# EasyEDA Pro project ProPrj_STM32H723.epro, board PCB1
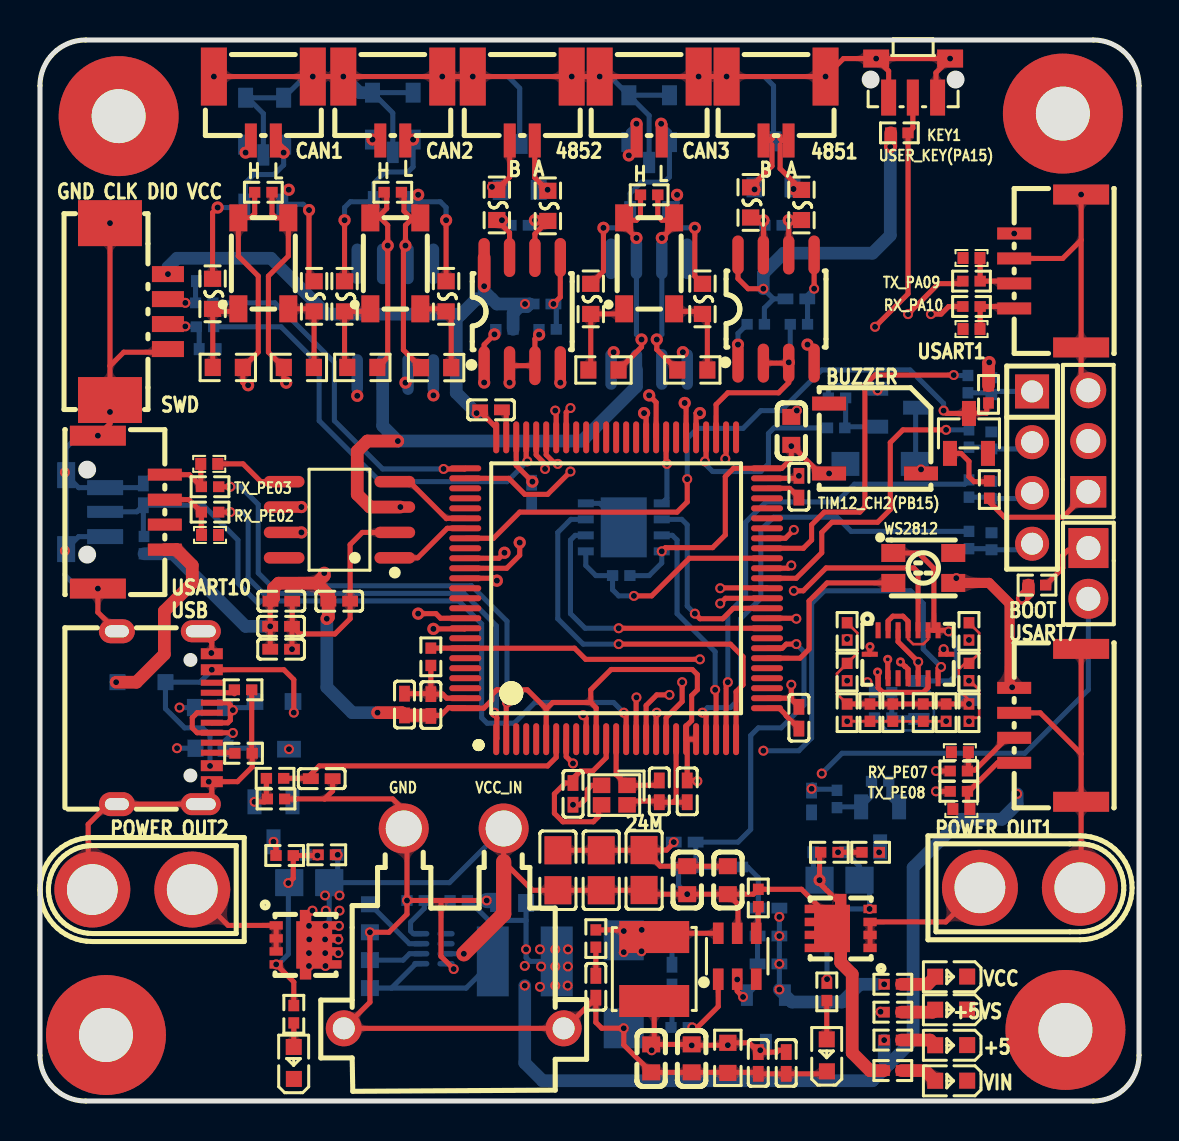
[diagram p5: board, top side]
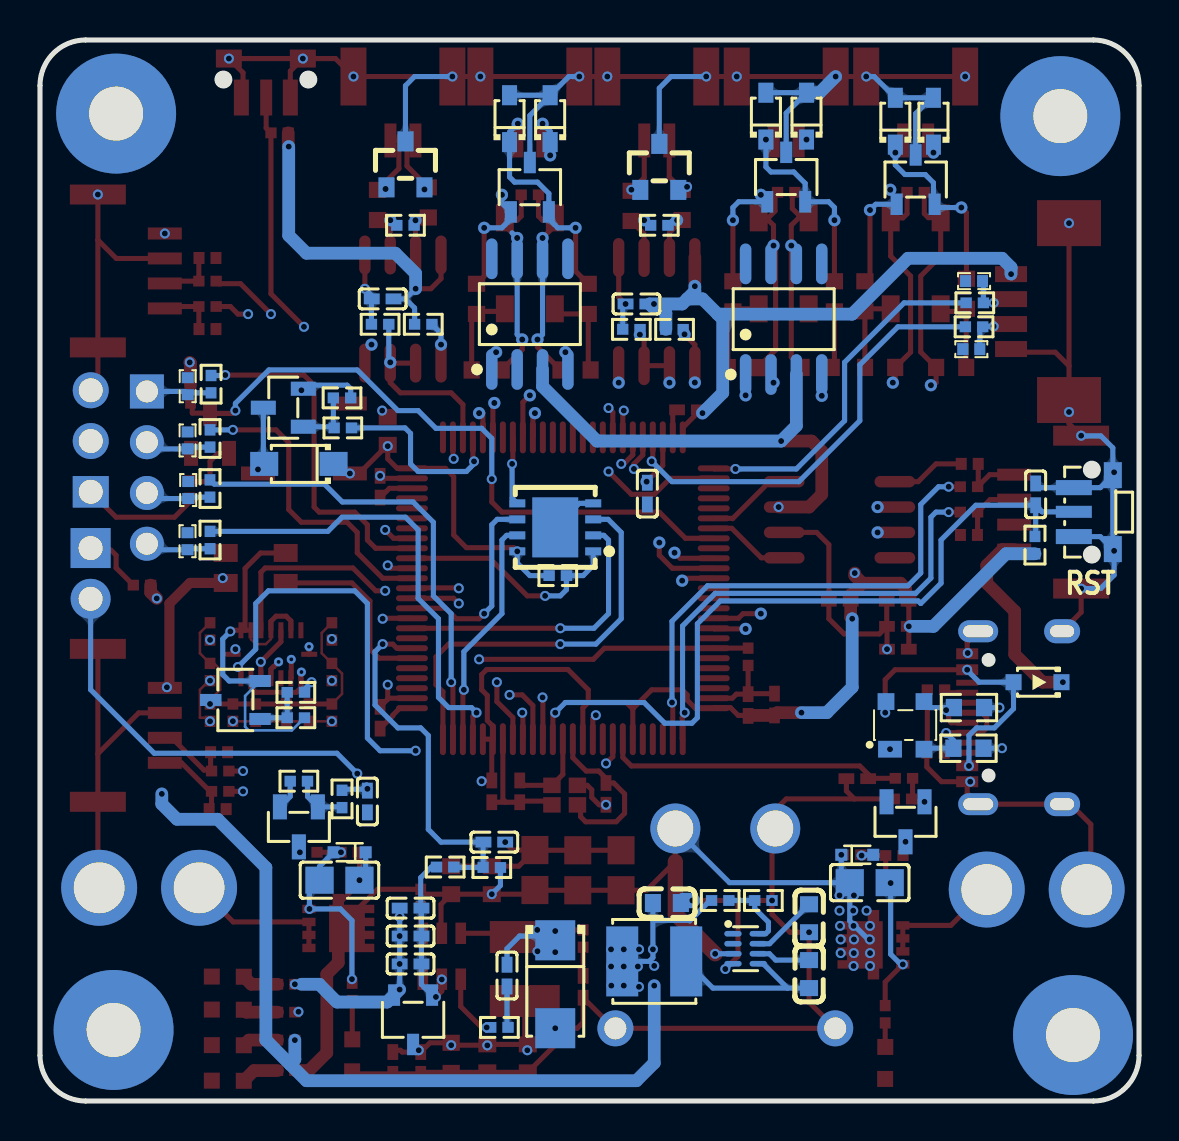
[diagram p6: board, bottom side, seen from below]

Outline 54.99 x 53.09 mm; copper layers: Top Layer, Inner1, Inner2, Bottom Layer. Coordinates in mm from the lower left corner of the outline.
Outline path: 0,50.8 0,2.29 arc(0.67,0.67) 2.29,0 52.71,0 arc(54.32,0.67) 54.99,2.29 54.99,50.8 arc(54.32,52.42) 52.71,53.09 2.29,53.09 arc(0.67,52.42) 0,50.8
Stack: Top Layer 0.035mm 外层铜厚1oz / Dielectric1 0.2104mm 7628 RC49% 8.6mil / Inner1 0.0152mm 内层铜厚 / Dielectric2 1.065mm 1.1mm H/HOZ 含铜 / Inner2 0.0152mm 内层铜厚 / Dielectric3 0.2104mm 7628 RC49% 8.6mil / Bottom Layer 0.035mm 外层铜厚1oz

## Design rules (mm)
template: 自定义配置
spacing copperThickness1oz (default): track to track 0.102, other pairs 0.076 to 0.3
spacing copperThickness2oz: track to track 0.203, other pairs 0.152 to 0.3
track width copperThickness1oz (default): min 0.127, default 0.254, max 2.54
track width copperThickness2oz: min 0.203, default 0.254, max 2.54
differential pair differentialPair (default): width min 0.127, default 0.254, max 2.54; gap min 0.152, default 0.152
via viaSize (default): diameter min 0.45, default 0.61, max 10; hole min 0.201, default 0.305, max 6.299

## Placement (name value [footprint] x y rotation side)
BUZZER1  4kHz  [BUZ-SMD_L5.0-W5.5-P4.60]  41.78 33.15 0 top
C1  2.2uF  [C0402]  37.97 30.73 270 top
C2  2.2uF  [C0402]  24.6 30.39 270 bottom
C3  10pF  [C0402]  30.99 15.49 270 top
C4  10pF  [C0402]  26.67 15.37 90 top
C5  100nF  [C0402]  5.17 30.35 270 bottom
C6  100nF  [C0402]  12.08 25.01 180 top
C7  100nF  [C0402]  12.06 22.61 180 top
C8  100nF  [C0402]  12.06 23.75 180 top
C9  100nF  [C0402]  22.57 34.58 180 top
C10  100nF  [C0402]  37.97 19.18 90 top
C11  100nF  [C0402]  19.56 19.81 270 top
C12  100nF  [C0402]  14.97 25.01 180 top
C13  100nF  [C0402]  32.38 15.49 90 top
C14  100nF  [C0402]  18.24 19.84 90 top
C15  100nF  [C0402]  32.26 12.95 0 bottom
C16  22uF  [C0603]  37.59 33.53 270 top
C17  10uF  [C0805]  30.23 11.56 270 top
C18  100nF  [C0603]  32.38 11.05 270 top
C19  100nF  [C0603]  16.51 6.35 270 bottom
C20  4.7uF  [C0603]  23.62 9.91 0 bottom
C21  33nF  [C0603]  16.51 9.14 270 bottom
C22  10uF  [C0805]  25.92 11.55 270 top
C23  10uF  [C0805]  28.08 11.55 270 top
C24  100nF  [C0603]  34.42 11.05 270 top
C25  100nF  [C0402]  31.62 6.28 90 bottom
C26  100nF  [C0402]  27.81 5.71 90 top
C27  33pF  [C0402]  35.94 1.9 90 top
C28  22uF  [C0603]  30.58 2.13 90 top
C29  22uF  [C0603]  32.61 2.13 90 top
C30  100nF  [C0402]  37.34 1.9 90 top
C31  100nF  [C0402]  36.45 9.65 0 bottom
C32  100nF  [C0402]  36.45 8.25 0 bottom
C33  100nF  [C0402]  36.45 6.86 0 bottom
C34  220nF  [C0805]  40 11.05 180 bottom
C35  100nF  [C0402]  38.61 14.99 90 bottom
C36  220nF  [C0805]  13.47 10.93 0 bottom
C37  100nF  [C0402]  14.1 16.13 180 top
C38  100nF  [C0402]  37.85 40.13 0 bottom
C39  100nF  [C0402]  25.15 39.88 0 bottom
CN1  532610471  [CONN-SMD_4P-P1.25_53261-0471]  4.95 39.5 270 top
CN2  A1257WV-S-4P-LCP  [CONN-SMD_A1257WV-S-4P]  50.42 18.8 90 top
CN3  A1257WV-S-4P-LCP  [CONN-SMD_A1257WV-S-4P]  4.57 29.46 270 top
CN4  A1257WV-S-4P-LCP  [CONN-SMD_A1257WV-S-4P]  50.42 41.53 90 top
CN5  XT30PW-M  [CONN-TH_XT30PW-M]  20.7 8.64 0 top
CN7  XT30U-M  [CONN-TH_XT30U-M]  49.53 10.67 0 top
CN8  XT30U-M  [CONN-TH_XT30U-M]  5.12 10.58 180 top
D2  PRTR5V0U2X  [SOT-143-4_L2.9-W1.3-P1.92-LS2.4-BL]  11.71 18.79 180 bottom
D3  SD103AWS  [SOD-323_L1.7-W1.3-LS2.5-RD]  5.08 20.95 0 bottom
D4  ESD9B5VL  [DFN1006-2L-BI]  8.39 37.62 180 bottom
D5  ESD9B5VL  [DFN1006-2L-BI]  8.25 41.02 180 bottom
D6  ESD9B5VL  [DFN1006-2L-BI]  46.03 17.45 0 top
D7  ESD9B5VL  [DFN1006-2L-BI]  46.1 14.6 0 top
D8  ESD9B5VL  [DFN1006-2L-BI]  8.51 28.32 180 top
D9  ESD9B5VL  [DFN1006-2L-BI]  8.47 31.88 180 top
D10  ESD9B5VL  [DFN1006-2L-BI]  46.61 42.18 0 top
D11  ESD9B5VL  [DFN1006-2L-BI]  46.61 38.62 0 top
D12  DSK36  [SOD-123FL_L2.7-W1.8-LS3.8-RD]  42.04 31.88 0 bottom
D13  ESD9B5VL  [DFN1006-2L-BI]  47.6 35.76 270 bottom
D14  ESD9B5VL  [DFN1006-2L-BI]  47.6 33.05 270 bottom
D15  ESD9B5VL  [DFN1006-2L-BI]  47.58 30.57 270 bottom
D16  ESD9B5VL  [DFN1006-2L-BI]  47.61 28.01 270 bottom
D17  SS34  [SMA_L4.3-W2.6-LS5.2-RD]  29.21 5.84 270 bottom
D18  BZX584C9V1  [SOD-523_L1.2-W0.8-LS1.6-FD]  39.5 12.45 180 bottom
D19  BZX584C9V1  [SOD-523_L1.2-W0.8-LS1.6-FD]  14.1 12.32 0 bottom
D20  PESD1CAN  [SOT-23-3_L2.9-W1.6-P1.90-LS2.8-BR]  11.18 46.1 270 bottom
D21  PESD1CAN  [SOT-23-3_L2.9-W1.6-P1.90-LS2.8-BR]  17.65 46.23 270 bottom
D22  PESD1CAN  [SOT-23-3_L2.9-W1.6-P1.90-LS2.8-BR]  30.48 45.72 270 bottom
D23  1N5819WS  [SOD-323_L1.8-W1.3-LS2.5-RD]  10.29 49.02 90 bottom
D24  1N5819WS  [SOD-323_L1.8-W1.3-LS2.5-RD]  12.19 49.02 90 bottom
D25  1N5819WS  [SOD-323_L1.8-W1.3-LS2.5-RD]  16.64 49.28 90 bottom
D26  1N5819WS  [SOD-323_L1.8-W1.3-LS2.5-RD]  18.67 49.28 90 bottom
D27  1N5819WS  [SOD-323_L1.8-W1.3-LS2.5-RD]  29.46 49.15 90 bottom
D28  1N5819WS  [SOD-323_L1.8-W1.3-LS2.5-RD]  31.5 49.15 90 bottom
D29  PSM712  [SOT-23_L2.9-W1.3-P1.90-LS2.4-BR]  36.7 46.86 270 bottom
D30  PSM712  [SOT-23_L2.9-W1.3-P1.90-LS2.4-BR]  24 46.74 270 bottom
F1  JK-SMD0603-005  [F0603]  13.72 40.26 90 top
F2  JK-SMD0603-005  [F0603]  8.64 40.39 90 top
F3  JK-SMD0603-005  [F0603]  20.32 40.26 90 top
F4  JK-SMD0603-005  [F0603]  15.24 40.26 90 top
F5  JK-SMD0603-005  [F0603]  33.15 40.13 90 top
F6  JK-SMD0603-005  [F0603]  27.56 40.13 90 top
F7  JK-SMD0603-005  [F0603]  35.56 44.96 90 top
F8  JK-SMD0603-005  [F0603]  38.1 44.83 90 top
F9  JK-SMD0603-005  [F0603]  22.86 44.83 90 top
F10  JK-SMD0603-005  [F0603]  25.41 44.79 90 top
H1  PZ254V-11-02P  [HDR-TH_2P-P2.54-V-M]  52.46 26.4 270 top
H2  PZ254V-11-04P  [HDR-TH_4P-P2.54-V-M]  49.64 31.69 270 top
H3  2.54-1*3P针  [HDR-TH_3P-P2.54-V-M-1]  52.45 33.02 90 top
L1  10uH  [IND-SMD_L4.0-W4.0]  24.26 6.98 0 bottom
L2  10uH  [IND-SMD_L4.0-W4.0]  30.73 6.6 270 top
L7  ACT45B-101-2P-TL003  [FILTER-SMD_4P-L4.5-W3.2-TL_ACT45B]  11.18 41.91 90 top
L8  ACT45B-101-2P-TL003  [FILTER-SMD_4P-L4.5-W3.2-TL_ACT45B]  17.78 41.91 90 top
L9  ACT45B-101-2P-TL003  [FILTER-SMD_4P-L4.5-W3.2-TL_ACT45B]  30.48 41.91 90 top
LED1  XL-3528RGBW-WS2812B  [LED-SMD_4P-L3.5-W2.8-BR-1]  44.2 26.67 180 top
LED2  KT-0603R  [LED0603-RD]  39.37 2.29 90 top
LED3  KT-0603R  [LED0603-RD]  12.7 1.9 90 top
LED4  KT-0603R  [LED0603-RD]  45.59 6.22 180 top
LED5  KT-0603R  [LED0603-RD]  45.59 1.02 180 top
LED6  KT-0603R  [LED0603-RD]  45.59 2.79 180 top
LED7  KT-0603R  [LED0603-RD]  45.59 4.57 180 top
NOREF  -  [Pad_e340]  51.18 49.4 0 top
NOREF#2  -  [Pad_e373]  3.3 3.3 0 top
NOREF#3  -  [Pad_e336]  3.94 49.28 0 top
NOREF#4  -  [Pad_e374]  51.31 3.56 0 top
Q1  CJ2310  [SOT-23-3_L2.9-W1.6-P1.90-LS2.8-BR]  45.21 20.07 180 bottom
Q2  SS8050  [SOT-23-3_L2.9-W1.3-P1.90-LS2.4-BR]  42.81 34.69 180 bottom
Q3  SS8050  [SOT-23-3_L2.9-W1.3-P1.90-LS2.4-BR]  42.04 13.72 90 bottom
Q4  SS8050  [SOT-23-3_L2.9-W1.3-P1.90-LS2.4-BR]  11.68 13.97 90 bottom
Q5  SS8050  [SOT-23-3_L2.9-W1.3-P1.90-LS2.4-BR]  46.48 33.4 270 top
R1  22Ω  [R0603]  8.51 19.68 0 bottom
R2  22Ω  [R0603]  8.53 17.65 0 bottom
R8  22Ω  [R0402]  49.89 25.81 180 top
R9  10kΩ  [R0402]  19.56 22.22 270 top
R10  10kΩ  [R0402]  5.21 27.81 270 bottom
R11  4.7kΩ  [R0402]  10.16 20.57 180 top
R12  4.7kΩ  [R0402]  10.19 17.4 180 top
R13  10kΩ  [R0402]  29.08 26.29 180 bottom
R14  22Ω  [R0402]  8.22 39.93 180 bottom
R15  22Ω  [R0402]  8.25 38.73 180 bottom
R16  22Ω  [R0402]  45.97 16.51 0 top
R17  22Ω  [R0402]  45.97 15.49 0 top
R18  22Ω  [R0402]  8.51 29.46 180 top
R19  22Ω  [R0402]  8.51 30.73 180 top
R20  22Ω  [R0402]  46.61 41.02 0 top
R21  22Ω  [R0402]  46.61 39.75 0 top
R22  470Ω  [R0402]  45.34 19.43 270 top
R23  470Ω  [R0402]  44.2 19.43 270 top
R24  470Ω  [R0402]  41.53 19.43 270 top
R25  470Ω  [R0402]  42.67 19.43 270 top
R26  470Ω  [R0402]  40.39 19.43 270 top
R27  470Ω  [R0402]  46.48 19.43 270 top
R28  470Ω  [R0402]  40.39 21.46 270 top
R29  470Ω  [R0402]  46.48 21.46 270 top
R30  470Ω  [R0402]  40.39 23.49 270 top
R31  470Ω  [R0402]  46.48 23.49 270 top
R32  10kΩ  [R0402]  42.19 19.18 0 bottom
R33  100Ω  [R0402]  42.19 20.45 0 bottom
R34  100kΩ  [R0402]  32.38 11.68 180 bottom
R35  10kΩ  [R0402]  34.72 11.71 180 bottom
R36  10kΩ  [R0402]  39.88 35.18 0 bottom
R37  22Ω  [R0402]  39.84 33.68 0 bottom
R38  22Ω  [R0402]  46.48 28.07 90 bottom
R39  22Ω  [R0402]  46.48 30.64 90 bottom
R40  22Ω  [R0402]  46.48 33.15 90 bottom
R41  22Ω  [R0402]  46.43 35.87 90 bottom
R42  51kΩ  [R0402]  20.96 10.03 0 bottom
R43  10kΩ  [R0402]  18.8 10.03 0 bottom
R44  100kΩ  [R0402]  35.94 10.16 270 top
R45  10Ω  [R0402]  32 3.68 180 bottom
R46  10Ω  [R0402]  27.81 8.13 90 top
R47  39kΩ  [R0603]  34.42 2.16 90 top
R48  10kΩ  [R0402]  39.5 12.45 180 top
R49  10kΩ  [R0402]  41.56 12.44 180 top
R50  1kΩ  [R0402]  39.88 15.11 90 bottom
R51  10kΩ  [R0402]  42.04 16 180 bottom
R52  100kΩ  [R0402]  39.37 5.46 90 top
R53  10kΩ  [R0402]  14.35 12.32 0 top
R54  10kΩ  [R0402]  12.24 12.28 0 top
R55  1kΩ  [R0402]  11.76 16.14 0 top
R56  10kΩ  [R0402]  11.81 15.11 180 top
R57  100kΩ  [R0402]  12.7 4.34 90 top
R58  120Ω  [R0402]  11.18 45.47 0 top
R59  120Ω  [R0402]  17.65 45.47 0 top
R60  120Ω  [R0402]  30.48 45.34 0 top
R61  2.2Ω  [R0603]  12.95 36.7 0 top
R62  2.2Ω  [R0603]  9.4 36.7 180 top
R63  2.2Ω  [R0603]  19.82 36.69 0 top
R64  2.2Ω  [R0603]  16.13 36.7 180 top
R65  2.2Ω  [R0603]  32.64 36.58 0 top
R66  2.2Ω  [R0603]  28.19 36.58 180 top
R68  120Ω  [R0402]  36.7 43.81 180 bottom
R69  10kΩ  [R0402]  23.24 38.61 0 bottom
R70  10kΩ  [R0402]  35.81 38.86 0 bottom
R71  10kΩ  [R0402]  37.97 38.86 180 bottom
R72  10kΩ  [R0402]  25.4 38.61 180 bottom
R73  120Ω  [R0402]  24 43.81 180 bottom
R74  4.7kΩ  [R0402]  47.5 30.59 90 top
R75  4.7kΩ  [R0402]  47.46 35.35 90 top
R76  10kΩ  [R0402]  43 48.44 180 top
R96  10kΩ  [R0402]  42.67 4.44 0 top
R97  10kΩ  [R0402]  42.67 3.05 0 top
R98  10kΩ  [R0402]  42.67 1.52 0 top
R99  10kΩ  [R0402]  42.67 5.84 0 top
SW1  SKRTLAE010  [KEY-SMD_SKRTLAE010]  43.69 51.18 180 top
SW2  SKRTLAE010  [KEY-SMD_SKRTLAE010]  2.29 29.46 90 bottom
U1  STM32H723VGT6  [LQFP-100_L14.0-W14.0-P0.50-LS16.0-BL]  28.83 25.65 0 top
U2  W25Q64JVXGIQ  [XSON-8_L4.0-W4.0-P0.80-TL-EP]  29.21 28.7 0 bottom
U3  BMI088  [LGA-16_L4.5-W3.0-P0.50-BL]  43.43 22.35 270 top
U4  TPS62932DRLR  [SMD-8_L2.1-W1.2-P0.50-LS1.6-BL]  19.69 7.62 270 bottom
U5  BL9342  [SOT-23-6_L2.9-W1.6-P0.95-LS2.8-BL]  34.89 7.24 0 top
U6  XC6206P332MR-G  [SOT-23-3_L2.9-W1.6-P1.90-LS2.8-BR]  36.32 4.06 90 bottom
U9  S40N06D  [WDFN-5_L3.3-W3.3-P0.65-BL]  40.8 8.63 90 top
U11  S40N06D  [WDFN-5_L3.3-W3.3-P0.65-BL]  12.55 7.81 270 top
U13  TJA1057T/1Z  [SOP-8_L5.0-W4.0-P1.27-LS6.0-BL]  17.78 39.12 180 bottom
U14  TJA1057T/1Z  [SOP-8_L5.0-W4.0-P1.27-LS6.0-BL]  14.99 29.08 90 top
U15  TJA1057T/1Z  [SOP-8_L5.0-W4.0-P1.27-LS6.0-BL]  30.48 39.37 180 bottom
U16  SM02B-GHS-TB(LF)(SN)  [CONN-SMD_SM02B-GHS-TB-LF-SN]  11.18 49.66 180 top
U17  SM02B-GHS-TB(LF)(SN)  [CONN-SMD_SM02B-GHS-TB-LF-SN]  17.65 49.66 180 top
U18  SM02B-GHS-TB(LF)(SN)  [CONN-SMD_SM02B-GHS-TB-LF-SN]  30.48 49.66 180 top
U19  SP3485EN-L/TR  [SOIC-8_L5.0-W4.0-P1.27-LS6.0-BL]  36.83 39.62 0 top
U20  SP3485EN-L/TR  [SOIC-8_L5.0-W4.0-P1.27-LS6.0-BL]  24.13 39.5 0 top
U21  SM02B-GHS-TB(LF)(SN)  [CONN-SMD_SM02B-GHS-TB-LF-SN]  36.83 49.66 180 top
U22  SM02B-GHS-TB(LF)(SN)  [CONN-SMD_SM02B-GHS-TB-LF-SN]  24.13 49.66 180 top
USB1  TYPE-C 16PIN 2MD(073)  [USB-C-SMD_TYPE-C-6PIN-2MD-073]  6.22 19.18 270 top
X1  24MHz  [CRYSTAL-SMD_4P-L2.0-W1.6-BL-A]  28.74 15.31 180 top

## Footprints (pads in the part's own frame, mm; a bottom-side part is the same pattern mirrored in y, then rotated)
BUZ-SMD_L5.0-W5.5-P4.60
  rect 1.7x0.7 smd: 1(-2.3,-1.75) 2(2.3,-1.75) 3(-2.3,1.75)
C0402
  rect 0.79x0.54 smd: 1(-0.545,0) 2(0.545,0)
C0603
  rect 0.8x0.9 smd: 1(-0.7,0) 2(0.7,0)
C0805
  rect 1.41x1.35 smd: 1(-1,0) 2(1,0)
CONN-SMD_4P-P1.25_53261-0471
  rect 0.8x1.6 smd: 1(-1.875,1.45) 2(-0.625,1.45) 3(0.625,1.45) 4(1.875,1.45)
  rect 2.3x3.2 smd: 5(4.425,-1.45) 6(-4.425,-1.45)
CONN-SMD_A1257WV-S-4P
  rect 0.6x1.7 smd: 1(1.875,1.675) 2(0.625,1.675) 3(-0.625,1.675) 4(-1.875,1.675)
  rect 1x2.8 smd: 5(3.825,-1.675) 6(-3.825,-1.675)
CONN-SMD_SM02B-GHS-TB-LF-SN
  rect 0.6x1.7 smd: 1(-0.625,1.6) 2(0.625,1.6)
  rect 1.3x2.9 smd: 3(2.475,-1.6) 4(-2.475,-1.6)
CONN-TH_XT30PW-M
  round 2.5 hole 1.8: 1(-2.5,5) 2(2.5,5)
  round 1.8 hole 1.1: 3(5.5,-5) 4(-5.5,-5)
CONN-TH_XT30U-M
  round 3.8 hole 2.54: 1(-2.5,0) 2(2.5,0)
CRYSTAL-SMD_4P-L2.0-W1.6-BL-A
  rect 0.875x0.775 smd: 1(-0.638,-0.488) 2(0.638,-0.488) 3(0.638,0.488) 4(-0.638,0.488)
DFN1006-2L-BI
  rect 0.55x0.6 smd: 1(-0.425,0) 2(0.425,0)
F0603
  rect 0.806x0.864 smd: 1(-0.753,0) 2(0.753,0)
FILTER-SMD_4P-L4.5-W3.2-TL_ACT45B
  rect 1.35x0.9 smd: 1(-2.275,1.25) 2(-2.275,-1.25) 3(2.275,-1.25) 4(2.275,1.25)
HDR-TH_2P-P2.54-V-M
  rect 2x2 hole 1.2: 1(-1.27,0)
  round 2 hole 1.2: 2(1.27,0)
HDR-TH_3P-P2.54-V-M-1
  rect 1.575x1.8 hole 1.2: 1(-2.54,0)
  round 1.8 hole 1.2: 2(0,0) 3(2.54,0)
HDR-TH_4P-P2.54-V-M
  rect 1.7x1.7 hole 1.1: 1(-3.81,0)
  round 1.7 hole 1.1: 2(-1.27,0) 3(1.27,0) 4(3.81,0)
IND-SMD_L4.0-W4.0
  rect 1.6x3.5 smd: 1(-1.6,0) 2(1.6,0)
KEY-SMD_SKRTLAE010
  rect 0.75x1.8 smd: 1(-1.225,0.975) 3(1.225,0.975)
  rect 0.6x1.8 smd: 2(0.015,0.975)
  rect 1.3x0.9 smd: 4(-1.85,-0.975) 5(1.85,-0.975)
LED0603-RD
  rect 0.8x0.8 smd: 1(-0.799,-0.004) 2(0.799,0.004)
LED-SMD_4P-L3.5-W2.8-BR-1
  rect 1.2x0.9 smd: 1(1.5,-0.75) 2(1.5,0.75) 3(-1.5,0.75) 4(-1.5,-0.75)
LGA-16_L4.5-W3.0-P0.50-BL
  rect 0.8x0.25 smd: 1(-1.2,-1.498) 2(-1.2,-0.998) 3(-1.2,-0.498) 4(-1.2,0.002) 5(-1.2,0.502) 6(-1.2,1.002) 7(-1.2,1.502) 9(1.2,1.502) 10(1.2,1.002) 11(1.2,0.502) 12(1.2,0.002) 13(1.2,-0.498) 14(1.2,-0.998) 15(1.2,-1.498)
  rect 0.25x0.8 smd: 8(0,1.915) 16(0,-1.915)
LQFP-100_L14.0-W14.0-P0.50-LS16.0-BL
  oval 0.3x1.6 smd: 1(-6,-7.55) 2(-5.5,-7.55) 3(-5,-7.55) 4(-4.5,-7.55) 5(-4,-7.55) 6(-3.5,-7.55) 7(-3,-7.55) 8(-2.5,-7.55) 9(-2,-7.55) 10(-1.5,-7.55) 11(-1,-7.55) 12(-0.5,-7.55) 13(0,-7.55) 14(0.5,-7.55) 15(1,-7.55) 16(1.5,-7.55) 17(2,-7.55) 18(2.5,-7.55) 19(3,-7.55) 20(3.5,-7.55) 21(4,-7.55) 22(4.5,-7.55) 23(5,-7.55) 24(5.5,-7.55) 25(6,-7.55) 51(6,7.55) 52(5.5,7.55) 53(5,7.55) 54(4.5,7.55) 55(4,7.55) 56(3.5,7.55) 57(3,7.55) 58(2.5,7.55) 59(2,7.55) 60(1.5,7.55) 61(1,7.55) 62(0.5,7.55) 63(0,7.55) 64(-0.5,7.55) 65(-1,7.55) 66(-1.5,7.55) 67(-2,7.55) 68(-2.5,7.55) 69(-3,7.55) 70(-3.5,7.55) 71(-4,7.55) 72(-4.5,7.55) 73(-5,7.55) 74(-5.5,7.55) 75(-6,7.55)
  oval 1.6x0.3 smd: 26(7.55,-6) 27(7.55,-5.5) 28(7.55,-5) 29(7.55,-4.5) 30(7.55,-4) 31(7.55,-3.5) 32(7.55,-3) 33(7.55,-2.5) 34(7.55,-2) 35(7.55,-1.5) 36(7.55,-1) 37(7.55,-0.5) 38(7.55,0) 39(7.55,0.5) 40(7.55,1) 41(7.55,1.5) 42(7.55,2) 43(7.55,2.5) 44(7.55,3) 45(7.55,3.5) 46(7.55,4) 47(7.55,4.5) 48(7.55,5) 49(7.55,5.5) 50(7.55,6) 76(-7.55,6) 77(-7.55,5.5) 78(-7.55,5) 79(-7.55,4.5) 80(-7.55,4) 81(-7.55,3.5) 82(-7.55,3) 83(-7.55,2.5) 84(-7.55,2) 85(-7.55,1.5) 86(-7.55,1) 87(-7.55,0.5) 88(-7.55,0) 89(-7.55,-0.5) 90(-7.55,-1) 91(-7.55,-1.5) 92(-7.55,-2) 93(-7.55,-2.5) 94(-7.55,-3) 95(-7.55,-3.5) 96(-7.55,-4) 97(-7.55,-4.5) 98(-7.55,-5) 99(-7.55,-5.5) 100(-7.55,-6)
Pad_e336
  round 6 hole 2.7: 101(0,0)
Pad_e340
  round 6 hole 2.7: 101(0,0)
Pad_e373
  round 6 hole 2.7: 101(0,0)
Pad_e374
  round 6 hole 2.7: 101(0,0)
R0402
  rect 0.566x0.54 smd: 1(-0.433,0) 2(0.433,0)
R0603
  rect 0.806x0.864 smd: 1(-0.753,0) 2(0.753,0)
SMA_L4.3-W2.6-LS5.2-RD
  rect 2x2 smd: 1(-2.2,0) 2(2.2,0)
SMD-8_L2.1-W1.2-P0.50-LS1.6-BL
  oval 0.28x0.864 smd: 1(-0.75,-0.632) 2(-0.25,-0.632) 3(0.25,-0.632) 4(0.75,-0.632) 5(0.75,0.632) 6(0.25,0.632) 7(-0.25,0.632) 8(-0.75,0.632)
SOD-123FL_L2.7-W1.8-LS3.8-RD
  rect 1.4x1.2 smd: 1(-1.735,0) 2(1.735,0)
SOD-323_L1.7-W1.3-LS2.5-RD
  rect 0.8x0.8 smd: 1(-1.2,0) 2(1.2,0)
SOD-323_L1.8-W1.3-LS2.5-RD
  rect 1x0.75 smd: 1(-1.173,0) 2(1.173,0)
SOD-523_L1.2-W0.8-LS1.6-FD
  rect 0.6x0.6 smd: 1(-0.8,0) 2(0.8,0)
SOIC-8_L5.0-W4.0-P1.27-LS6.0-BL
  oval 0.569x1.95 smd: 1(-1.905,-2.705) 2(-0.635,-2.705) 3(0.635,-2.705) 4(1.905,-2.705) 5(1.905,2.705) 6(0.635,2.705) 7(-0.635,2.705) 8(-1.905,2.705)
SOP-8_L5.0-W4.0-P1.27-LS6.0-BL
  oval 0.574x2.035 smd: 1(-1.905,-2.768) 2(-0.635,-2.768) 3(0.635,-2.768) 4(1.905,-2.768) 5(1.905,2.768) 6(0.635,2.768) 7(-0.635,2.768) 8(-1.905,2.768)
SOT-23-3_L2.9-W1.3-P1.90-LS2.4-BR
  rect 1.25x0.7 smd: 1(1,-0.95) 2(1,0.95) 3(-1,0)
SOT-23-3_L2.9-W1.6-P1.90-LS2.8-BR
  rect 1.07x0.6 smd: 1(1.235,-0.95) 2(1.235,0.95) 3(-1.235,0)
SOT-23-6_L2.9-W1.6-P0.95-LS2.8-BL
  rect 0.532x1.072 smd: 1(-0.95,-1.149) 2(0,-1.149) 3(0.95,-1.149) 4(0.95,1.149) 5(0,1.149) 6(-0.95,1.149)
SOT-23_L2.9-W1.3-P1.90-LS2.4-BR
  rect 1x0.8 smd: 1(1.15,-0.95) 2(1.15,0.95) 3(-1.15,0)
SOT-143-4_L2.9-W1.3-P1.92-LS2.4-BL
  rect 1.194x0.838 smd: 1(-0.75,-1.192)
  rect 0.838x0.838 smd: 2(0.95,-1.192) 3(0.95,1.192) 4(-0.95,1.192)
USB-C-SMD_TYPE-C-6PIN-2MD-073
  rect 0.55x1.1 smd: 1(-3.2,2.375) 2(-2.4,2.375) 11(2.4,2.375) 12(3.2,2.375)
  rect 0.3x1.1 smd: 3(-1.75,2.375) 4(-1.25,2.375) 5(-0.75,2.375) 6(-0.25,2.375) 7(0.25,2.375) 8(0.75,2.375) 9(1.25,2.375) 10(1.75,2.375)
  oval 1.1x2 hole 0.6x1.5: 13(-4.325,1.825) 14(4.325,1.825)
  oval 1.2x1.8 hole 0.6x1.2: 13(-4.325,-2.375) 14(4.325,-2.375)
WDFN-5_L3.3-W3.3-P0.65-BL
  rect 0.42x0.66 smd: 1(-0.975,-0.735) 2(-0.325,-0.735) 3(0.325,-0.735) 4(0.975,-0.735)
  custom 3.48x2.265 smd: 5(0,0.735)
XSON-8_L4.0-W4.0-P0.80-TL-EP
  rect 0.8x0.4 smd: 1(-1.9,1.2) 2(-1.9,0.4) 3(-1.9,-0.4) 4(-1.9,-1.2) 5(1.9,-1.2) 6(1.9,-0.4) 7(1.9,0.4) 8(1.9,1.2)
  rect 2.3x3 smd: 9(0,0)

## Nets
As in the schematic.

Pads without a net: BUZZER1 3; LED1 4; NOREF 101; NOREF#2 101; NOREF#3 101; NOREF#4 101; U1 9; U3 1 13; U4 1 2; U5 3; USB1 3 9

## Via types
v1: diameter 0.5, hole 0.3, Top Layer to Bottom Layer, 185 vias
v2: diameter 0.5, hole 0.299, Top Layer to Bottom Layer, 5 vias
v3: diameter 0.61, hole 0.305, Top Layer to Bottom Layer, 56 vias
v4: diameter 0.45, hole 0.2, Top Layer to Bottom Layer, 4 vias

## Routing (per net, layer and track width the routed paths; a pad name or vN(x,y) marks a point on that pad's centre or on a via; arc(x,y) is an arc through that point)
+5V: length 127.5
  Top Layer w0.508: LED1.3 47.49,25.92 48.51,24.89 48.51,20.9 CN2.1
  Top Layer w0.635: CN3.1 6.83,27.59 7.62,26.8 7.62,25.91 6.22,24.51 6.22,22.35 4.83,20.95 v1(3.81,20.95)
  Inner2 w0.635: 12.95,13.97 14.26,13.97 17.06,11.18 22.48,11.18 24.64,9.02 ; v1(48.9,15.37) 48.9,20.45 v1(48.64,20.7) 50.93,22.99 50.93,25.27 50.04,26.16 48.9,26.16 47.75,27.3 47.75,36.07 50.16,38.48 50.16,42.29 49.02,43.43 ; 12.7,13.97 9.53,13.97 9.02,13.46 7.05,13.46 3.81,16.7 v1(3.81,20.95)
  Bottom Layer w0.254: L1.2 24.51,6.98 24.32,7.17 v1(24.32,7.59) 24.32,9.04 ; 24.32,9.04 22.5,9.04 22.48,9.02 21.46,10.03 R42.2 ; 24.32,9.04 C20.2
  Bottom Layer w0.635: 42.48,1.84 41.66,1.02 25.15,1.02 24.26,1.9 v1(24.26,5.77) ; 42.48,1.84 43.69,3.05 43.69,11.68 46.1,14.1 48.13,14.1 48.9,14.86 v1(48.9,15.37) ; 42.48,1.84 42.24,2.08 v2(42.24,3.05)
  vias: v1(24.26,6.76) v1(25.02,7.59) v1(25.02,5.71) v1(25.08,6.73) v1(25.78,7.59) v1(25.78,6.73) v1(25.78,5.77) v1(26.42,7.59) v1(26.42,6.73) v1(26.4,5.77) v1(45.85,26.16) v1(48.74,43.4)
+5VS: length 116.9
  Top Layer w0.254: L2.2 30.73,2.98 C28.2 C29.2 32.65,2.79 v1(34.42,2.79) R47.2 35.48,2.91 35.94,2.45 36.87,2.45 36.96,2.54 37.25,2.54 37.34,2.45
  Top Layer w0.635: v1(17.91,33.02) 16.38,33.02 15.88,32.51 15.88,30.35 16.51,29.72 v1(18.03,29.72)
  Inner2 w0.635: v1(18.03,29.72) 17.65,29.34 17.65,19.3 20.96,16 24.38,16 31.24,9.14 31.24,3.17 v1(30.61,2.54) ; H3.2 54.36,31.11 54.36,15.49 53.09,14.22 44.58,14.22 43.05,12.7 43.05,5.46 v2(42.06,4.46) 40.13,2.54 v1(36.04,2.54) 34.8,2.54
  Bottom Layer w0.254: U6.3 36.32,2.82 v1(36.04,2.54)
  Bottom Layer w0.635: U13.3 17.15,33.78 v1(17.91,33.02) 27.12,33.02 29.84,35.75 U15.3
  vias: v1(32.61,2.78)
GND: length 300.9
  Top Layer w0.127: U3.6 44.44,23.1 44.2,22.86 43.69,22.86 43.44,23.11 U3.4
  Top Layer w0.254: CN7.2 52.09,10.73 CN2.6 52.09,17.37 ; v1(25.69,39.88) 26.03,40.22 U20.5 ; C11.1 19.53,20.38 C14.2 ; C11.1 R9.2 ; C11.1 20.15,20.36 20.35,20.15 U1.99 ; C8.1 12.62,23.76 C6.1 ; C8.1 v1(12.61,22.61) ; C8.1 12.99,23.37 14.76,23.37 15.52,24.13 15.52,27.84 16.13,28.45 U14.2 ; v1(20.7,6.6) 20.07,7.24 20.07,10.02 20.08,10.03 ; 52.09,43.08 CN4.6 52.09,35.92 H3.3 ; 52.09,43.08 51.17,42.15 CN4.2 ; 52.09,43.08 v1(52.09,45.35) ; 44.73,23.55 44.73,26.65 43.95,27.42 LED1.1 ; 44.73,23.55 U3.6 ; 44.73,23.55 U3.7 45.41,23.55 v1(45.47,23.49) ; SW1.1 44.83,50.29 44.83,51.45 v1(45.54,52.16) v1(41.84,52.16) ; USB1.13 2.9,24.45 v1(2.9,25.64) ; v1(41.84,52.16) 40.2,52.16 v1(39.31,51.26) v1(34.35,51.26) v1(32.96,51.26) v1(28,51.26) v1(26.6,51.26) v1(21.66,51.26) v1(20.13,51.26) v1(15.18,51.26) v1(13.65,51.26) v1(8.7,51.26) ; v1(41.84,52.16) 42.46,51.53 SW1.3 ; 29.59,15.01 31.06,15.01 31.12,14.95 31.69,14.95 ; 14.24,15.11 R56.1 ; 14.24,15.11 17.65,15.11 18.2,14.56 CN5.1 18.36,13.47 v1(18.36,10.03) ; 14.24,15.11 14.64,15.51 C37.1 ; U1.26 36.99,19.65 37.34,19.3 37.34,19.27 C10.1 ; v1(2.9,33.29) 3.5,33.89 v1(3.5,34.47) CN1.5 3.5,36.78 ; U3.2 42.44,24.02 42.67,24.26 43.18,24.26 43.44,24 U3.4 ; 31.69,14.95 31.83,15.09 U1.19 ; 31.69,14.95 C13.1 ; v1(37.97,31.28) 37.85,31.15 U1.49 ; 3.5,36.78 v1(3.5,43.92) ; 3.5,36.78 4.19,37.46 6.25,37.46 CN1.4 ; v1(22.35,10.03) 20.08,10.03 ; 20.08,10.03 v1(18.36,10.03) ; X1.2 27.6,15.79 27.38,15.57 27.38,15.19 27.01,14.82 v1(26.67,14.82) ; U1.10 27.33,19.15 v1(27.18,19.3) ; CN8.2 2.41,10.79 2.41,13.84 3.42,14.85 USB1.14 USB1.14 8.6,15.4 USB1.12 9.88,15.98 10.62,16.71 R12.1 10.59,17.42 R11.1 ; 52.09,17.37 50.05,19.42 CN2.2 ; 52.09,17.37 CN2.5 ; C17.1 30.21,12.55 C23.1 C22.1 ; C17.1 31.03,11.75 C18.1 C24.1 34.54,11.62 ; C17.1 31.35,12.56 31.62,12.83 ; USB1.1 8.6,22.95 USB1.13 ; LED2.1 39.25,1.36 C30.1 C27.1 35.87,1.43 C29.1 C28.1 29.21,2.81 v1(29.21,3.64) 28.11,3.64 27.81,3.94 C26.1 26.28,3.64 CN5.3 CN5.4 16.51,4.94 v1(16.51,8.44) 17.46,8.44 18.36,9.35 v1(18.36,10.03) ; U19.5 v1(38.74,40.64) ; v1(34.89,6.08) 34.89,5.5 v1(35.18,5.21) ; U14.5 11.05,30.99 10.16,31.88 D9.1 ; C9.1 23.33,34.37 U1.74
  Bottom Layer w0.127: Q1.2 44.73,20.26 44.73,18.73 44.54,18.54 42.39,18.54 R32.1
  Bottom Layer w0.254: v1(20.7,6.6) 20.44,6.87 U4.4 ; C5.1 4.96,30.69 SW2.3 1.94,30.69 1.31,31.31 ; SW2.1 1.94,28.24 SW2.4 1.31,31.31 ; U2.4 28.01,29.9 U2.9 ; D21.3 17.65,49.43 D25.2 D26.2 ; R35.1 35.41,11.71 35.94,11.18 35.94,9.69 C31.1 C32.1 C33.1 35.9,5.83 U6.1 ; v1(45.47,23.49) 45.85,23.11 45.85,21.34 45.53,21.02 Q1.2 ; C38.2 38.39,40.17 38.41,40.18 ; D23.2 10.38,50.19 ; 10.38,50.19 11.18,49.4 D20.3 ; 10.38,50.19 D24.2 13.25,51.26 v1(13.65,51.26) ; v1(21.66,51.26) 23.42,51.26 24,50.67 D30.3 ; D27.2 D28.2 ; D27.2 28.53,51.26 v1(28,51.26) ; D27.2 30.48,49.31 D22.3 ; R72.1 25.83,39.74 v1(25.69,39.88) ; 1.31,31.31 1.31,32.68 1.91,33.27 2.88,33.27 v1(2.9,33.29) ; v1(38.74,40.64) 38.41,40.31 38.41,40.18 ; v1(1.25,27.53) 1.25,26.31 1.92,25.64 v1(2.9,25.64) ; 38.41,40.18 R71.1 ; Q2.2 41.64,35.81 39.62,35.81 39.44,35.63 39.44,35.18 ; v1(34.35,51.26) 36.25,51.26 36.7,50.8 D29.3 ; R51.1 42.47,15.23 Q3.2
  Bottom Layer w0.635: D25.2 15.99,50.45 v1(15.18,51.26)
  Bottom Layer w0.762: v1(22.35,10.03) 22.79,10.03 C20.1
  vias: v1(1.25,31.46) v1(8.45,15.98) v1(8.57,22.41) v1(12.46,17.6) v1(31.71,12.95) v1(37.87,34.54) v1(41.91,35.56) v3(18.29,35.94)
VCC: length 227.8
  Top Layer w0.254: 37.59,20.1 C10.2 ; 37.59,20.1 37.54,20.15 U1.27 ; 37.59,20.1 v1(37.59,20.83) ; C9.2 22.02,34.49 22.83,33.69 U1.75 ; 25.33,19.61 U1.6 ; 25.33,19.61 25.65,19.94 27.56,19.94 ; 25.33,19.61 25.33,19.63 24.38,20.57 22.86,20.57 22.61,20.32 22.61,20.05 22.21,19.65 U1.100 21.25,19.68 20.45,19.68 20.05,19.29 19.53,19.29 C11.2 ; 27.56,19.94 27.83,19.67 U1.11 ; 27.56,19.94 27.56,20.57 28.57,21.59 32.64,21.59 32.89,21.34 32.89,20.57 32.61,20.29 32.61,19.03 32.33,18.75 U1.20 ; U3.3 42.94,22.98 v1(43.94,21.97) 43.94,21.16 U3.11 ; v1(36.19,40.64) 35.43,40.64 34.93,41.15 U19.8 ; U1.20 U1.21 ; U1.20 32.38,18.05 C13.2 32.86,16.04 v1(32.89,16) ; C7.2 v1(11.52,23.75) 11.52,25 C6.2 ; v1(31.11,27.5) 31.29,27.69 33.66,27.69 34.29,28.32 34.29,31.24 34.7,31.65 U1.50 37.12,31.65 37.59,32.13 C16.2 39.02,31.4 v1(39.48,31.4)
  Top Layer w0.635: v1(49.15,25.15) 49.45,25.45 R8.2 ; v1(14.35,24.13) 14.43,24.21 C12.2 14.43,25.32 13.84,25.91 ; v1(47.5,36.96) 47.46,36.92 R75.2 ; R76.2 42.57,47.78 v1(42.54,47.75) ; 13.84,25.91 14.22,26.29 v1(14.22,26.42) ; 13.84,25.91 11.94,25.91 11.68,25.65 11.68,25.16 C6.2 ; v1(22.22,40.77) U20.8 ; v1(16.89,19.43) 18.1,19.43 C14.1 19.53,19.29
  Inner2 w0.381: v1(49.15,25.15) 48.73,25.57 44.83,25.57 44.69,25.43 44.06,25.43
  Inner2 w0.635: v1(36.99,9.21) 36.99,10.38 36.7,10.67 34.8,10.67 32.89,12.57 v1(32.89,16) 32.89,16.13 v1(37.59,20.83) 37.59,21.84 36.19,23.24 36.19,29.59 36.83,30.23 38.35,30.23 39.48,31.35 v1(39.48,31.4) 41.88,31.4 43.18,30.1 43.18,29.46 ; v1(43.94,21.97) 44.06,22.09 44.06,26.04 43.18,26.92 43.18,29.46 ; v1(47.5,36.96) 46.61,36.07 46.61,35.94 46.52,35.94 46.06,35.48 46.06,32.34 43.18,29.46 ; v1(37.59,32.77) 36.19,34.16 v1(36.19,40.64) 35.69,41.15 25.15,41.15 24.27,40.27 v1(24.27,39.88) ; v1(14.22,26.42) 14.6,26.8 14.6,33.27 15.24,33.91 21.34,33.91 v1(21.84,34.42)
  Bottom Layer w0.254: 36.7,40.13 v1(36.19,40.64) ; 36.7,40.13 37.3,40.13 ; 36.7,40.13 36.25,39.68 36.25,38.86 ; v1(39.48,31.4) 39.82,31.4 D12.1 ; 24.6,39.88 24.49,39.88 ; R13.1 30.48,26.29 31.11,26.92 v1(31.11,27.5) ; v1(36.99,5.58) v1(36.99,6.86) v1(36.99,8.25) v1(36.99,9.21) C31.2
  Bottom Layer w0.635: 41.91,5.84 41.02,5.84 40.13,4.95 37.62,4.95 U6.2 v1(36.99,5.58) ; v1(42.54,47.75) 42.54,43.31 41.66,42.42 37.21,42.42 36.19,41.4 v1(36.19,40.64) ; 22.61,40.13 22.86,39.88 24.49,39.88 24.36,39.75 24,39.75 23.67,39.42 R69.2 ; 22.61,40.13 22.22,40.51 v1(22.22,40.77) ; 22.61,40.13 21.84,40.13 21.08,39.37 ; v1(14.35,24.13) 14.35,20.7 15.62,19.43 v1(16.89,19.43) ; 21.08,39.37 20.83,39.12 20.83,35.43 v1(21.84,34.42) ; 21.08,39.37 14.35,39.37 11.56,42.16 6.86,42.16 6.4,41.71 v1(6.4,41.37) ; 11.43,23.75 10.29,23.75 6.66,27.38 R10.2
  vias: v2(42.24,5.84)
VCC_IN: length 102.7
  Top Layer w0.127: v1(40.39,19) 45.34,19 ; v1(46.48,21.03) 46.53,21.03 46.99,20.57 46.99,19.18 46.66,19.18 v1(46.48,19)
  Top Layer w0.254: CN5.2 23.2,11.98 24.63,10.55 C22.2 C23.2 30.21,10.55 C17.2 30.43,10.35 v1(32.38,10.35) C24.2 ; C24.2 34.93,9.84 34.93,8.43 U5.5 ; C24.2 35.7,10.35 R44.1 38.1,10.59 U9.5 40.06,9.85 39.12,10.79 ; v3(39,11.05) 39,12.39 R48.2
  Top Layer w0.635: U9.5 40.06,6.93 40.64,6.35 40.64,2.41 41.53,1.52 R98.1
  Top Layer w0.762: 23.2,11.98 23.2,9.36 v1(21.21,7.37)
  Inner2 w0.635: v1(46.48,19) 46.47,19.01 v1(45.34,19.01) 45.33,19 v1(40.39,19) v1(40.39,21.03) v1(40.39,23.12) 40.64,23.12 41.28,23.75 42.16,23.75 42.93,24.51 42.93,25.27 42.04,26.16 39.12,26.16 38.61,25.65 38.61,20.07 38.1,19.56 ; v1(46.48,23.07) v1(46.48,21.03) ; v3(39,11.05) 37.85,12.21 37.85,18.92 38.35,19.43
  Bottom Layer w0.254: R34.2 31.95,10.78 v1(32.38,10.35) ; C36.2 14.47,9.01 13.59,8.13 ; C36.2 20.49,10.93 CN5.2 ; C36.2 14.9,11.35 v1(14.9,12.32) ; D18.2 38.7,11.36 v3(39,11.05) ; v1(21.21,7.37) 21.21,7.37 U4.3
  vias: v1(13.46,8.76) v1(13.47,8.08) v1(13.46,7.4) v1(13.46,6.76) v1(13.63,9.52) v1(14.26,10.29) v1(14.3,9.52) v1(14.28,8.76) v1(14.26,8.08) v1(14.27,7.4) v1(14.28,6.76) v1(14.93,8.08) v1(14.93,7.4) v1(14.99,10.29) v1(14.99,9.52) v1(14.96,8.76)
VCC_OUTPUT1: length 7.5
  Top Layer w0.254: U9.1 U9.2 U9.3 45.32,8.96 CN7.1
VCC_OUTPUT2: length 6.2
  Top Layer w0.254: CN8.1 9.41,8.79 11.82,8.79 U11.3
485_A1: length 3.3
  Top Layer w0.254: 37.03,48.27 37.03,48.15 37.12,48.06 U21.1 ; 37.03,47.84 37.03,46.65 F8.2
  vias: v3(37.7,45.63)
485_A2: length 2.8
  Top Layer w0.254: F10.2 24.75,46.2 U22.1
  vias: v1(25.4,45.59)
485_B1: length 3.2
  Top Layer w0.254: U21.2 36.54,48.06 36.63,48.15 36.63,48.27 ; 36.63,47.84 36.63,46.78 F7.2
  vias: v3(35.75,45.61)
485_B2: length 2.7
  Top Layer w0.254: F9.2 23.5,46.23 U22.2
  vias: v1(22.61,45.74)
ADC_CH4_VBAT(PC04): length 18.5
  Top Layer w0.254: v1(37.85,22.86) 37.34,22.86 37.14,22.65 U1.32
  Bottom Layer w0.254: v1(37.85,22.86) 38.23,22.48 38.23,19.81 37.08,18.67 35.94,18.67 35.56,18.29 35.56,13.59 34.93,12.95 C15.2 32.82,12.94 R34.1 34.26,11.68 R35.2
BOOT: length 42.9
  Top Layer w0.254: v1(33.02,22.1) 27.31,22.1 26.75,22.65 U1.94 21.28,22.66 R9.1
  Inner1 w0.254: v1(39.12,16.38) 38.23,16.38 35.81,18.8 35.81,20.7 34.42,22.1 v1(33.02,22.1)
  Bottom Layer w0.254: v1(39.12,16.38) 40.13,17.4 49.28,17.4 52.46,20.58 H1.2
CAN1_H: length 9.8
  Top Layer w0.254: v3(13.46,44.58) 13.46,41.27 F1.2 ; U16.2 10.55,47.71 v3(10.29,47.45)
  Inner1 w0.254: v3(12.45,45.59) 12.45,45.97 12.06,46.35 10.67,46.35 10.29,46.74 v3(10.29,47.45)
  Bottom Layer w0.254: D23.1 v3(10.29,47.45) ; v3(13.46,44.58) 13.17,44.87 D20.1
CAN1_L: length 10.4
  Top Layer w0.254: U16.1 12.19,47.67 v3(12.19,47.45) ; 8.51,41.01 F2.2 8.64,44.45 v3(8.89,44.7)
  Bottom Layer w0.254: v3(8.89,44.7) 10.06,44.7 D20.2 10.29,44.93 10.29,45.94 10.7,46.35 11.72,46.35 12.19,46.83 v3(12.19,47.45) D24.1
CAN1_RX(PD00): length 4.3
  Top Layer w0.254: U1.81 20.35,29.15 20.34,29.14 18.48,30.99 U14.4
CAN1_TX(PD01): length 4.1
  Top Layer w0.254: U14.1 18.9,27.18 20.37,28.65 U1.82
CAN2_H: length 11.1
  Top Layer w0.254: v3(20.32,44.07) F3.2 ; U17.2 16.98,48.1 v3(16.64,48.1)
  Inner1 w0.254: v3(16.64,48.1) 16.64,46.74 16.89,46.48 18.54,46.48 18.92,46.1 v3(18.92,45.34)
  Bottom Layer w0.254: v3(20.32,44.07) 20.32,44.7 20.03,44.99 18.6,44.99 18.6,45.02 v3(18.92,45.34)
CAN2_L: length 10.3
  Top Layer w0.254: v3(15.24,44.07) F4.2 ; v3(18.67,48.1) 18.32,48.1 U17.1
  Bottom Layer w0.254: v3(15.24,44.07) 15.24,44.7 15.53,44.99 D21.2 16.7,45.91 17.27,46.48 18.41,46.48 18.67,46.74 v3(18.67,48.1)
CAN2_RX(PB05): length 15.7
  Top Layer w0.254: U1.91 20.04,24.15 19.81,24.38 v3(18.92,24.38)
  Inner1 w0.254: v3(15.88,35.28) 17.49,35.28 17.58,35.19 17.58,34.9 19.04,33.44 19.04,25.77 18.92,25.65 v3(18.92,24.38)
CAN2_TX(PB06): length 15.6
  Top Layer w0.254: U1.92 21.25,23.62 v3(19.69,23.62)
  Inner1 w0.254: v3(19.69,35.31) 18.07,35.31 17.98,35.22 17.98,35.07 19.44,33.61 19.44,25.77 19.69,25.53 v3(19.69,23.62)
CAN3_H: length 11.8
  Top Layer w0.254: v3(32.77,43.69) 32.77,41.27 F5.2 ; v3(29.46,47.31) 29.85,47.7 U18.2
  Inner1 w0.254: v3(31.88,45.34) 31.88,45.47 31.37,45.97 29.72,45.97 29.46,46.23 v3(29.46,47.31)
  Bottom Layer w0.254: D27.1 29.46,48.51 v3(29.84,48.89) ; v3(31.88,45.34) 31.88,44.93 D22.1 31.43,44.13 31.88,43.69 v3(32.77,43.69)
CAN3_L: length 11
  Top Layer w0.254: v3(28.19,43.69) 28.19,41.52 F6.2
  Bottom Layer w0.254: v3(28.19,43.69) 29.08,43.69 29.53,44.13 D22.2 29.53,45.4 30.1,45.97 31.24,45.97 31.5,46.23 D28.1 31.5,48.48 v3(31.08,48.89)
CAN3_RX(PD12): length 6.7
  Top Layer w0.254: U1.59 30.83,34.96 v3(30.48,35.31)
  Inner1 w0.254: v3(28.7,37.46) 29.84,37.46 30.23,37.08 30.23,35.56 v3(30.48,35.31)
  Bottom Layer w0.254: v3(28.7,37.46) 28.7,36.73 U15.4
CAN3_TX(PD13): length 7.2
  Top Layer w0.254: U1.60 30.33,34.31 v3(30.23,34.42)
  Inner1 w0.254: v3(32.17,37.46) 31.12,37.46 30.73,37.08 30.73,35.94 31.12,35.56 31.12,34.98 30.55,34.42 v3(30.23,34.42)
  Bottom Layer w0.254: v3(32.17,37.46) 32.38,37.25 U15.1
FB: length 3.7
  Bottom Layer w0.254: U4.8 18.68,8.37 18.54,8.51 18.54,8.95 19.23,9.64 R43.2 R42.1
MCU_RST: length 38.3
  Top Layer w0.254: U1.14 29.33,19.31 v1(29.21,19.43)
  Bottom Layer w0.254: C5.2 5.17,28.28 R10.1 ; C5.2 8.16,29.81 9.91,28.07 9.91,25.91 10.92,24.89 11.05,25.02 20.96,25.02 22.1,23.88 22.1,19.18 22.37,18.9 23.73,18.9 24.77,19.94 28.7,19.94 v1(29.21,19.43) ; C5.2 4.84,29.48 SW2.2
OCTOSPIM_P1_CLK(PB02): length 9.9
  Top Layer w0.254: v1(32.77,24.38) 33.02,24.13 34.16,24.13 34.69,24.65 U1.36
  Bottom Layer w0.254: v1(32.77,24.38) 32.38,24.76 32.38,28.83 32.11,29.1 U2.6
OCTOSPIM_P1_D0(PD11): length 3.4
  Top Layer w0.254: v1(31.37,31.88) 31.33,31.92 U1.58
  Bottom Layer w0.254: v1(31.37,31.88) 31.37,30.16 U2.5
OCTOSPIM_P1_D1(PB00): length 14.7
  Top Layer w0.254: U1.34 v1(28.96,23.65)
  Bottom Layer w0.254: v1(28.96,23.65) 27.27,23.65 26.54,24.38 26.54,28.07 26.78,28.3 27.31,28.3
OCTOSPIM_PI_D2(PA03): length 20.1
  Top Layer w0.254: v1(28.96,22.86) 34.54,22.86 35.18,22.22 35.18,20.83 34.83,20.48 U1.25
  Bottom Layer w0.254: 28.7,22.86 27.18,22.86 25.91,24.13 25.91,28.45 26.56,29.1 U2.3
OCTOSPIM_PI_D3(PA01): length 11.6
  Top Layer w0.254: U1.23 33.83,20.53 v1(33.78,20.57)
  Bottom Layer w0.254: v1(33.78,20.57) 33.78,22.48 31.88,24.38 31.88,28.07 31.64,28.3 31.11,28.3
OCTOSPIM_PI_NCS(PE11): length 11.6
  Top Layer w0.254: v1(29.72,25.27) 30.61,25.27 32.49,27.15 U1.41
  Bottom Layer w0.254: U2.1 27.31,26.79 27.81,26.29 R13.2 28.65,25.58 28.96,25.27 v1(29.72,25.27)
OSC_IN: length 8.5
  Top Layer w0.254: X1.3 27.94,14.66 27.94,14.22 27.69,13.97 26.16,13.97 25.74,14.39 25.74,15.37 26.28,15.91 C4.2 26.67,16.14 27.04,16.51 27.66,16.51 28.33,17.18 U1.12
OSC_OUT: length 4.3
  Top Layer w0.254: U1.13 28.83,16.34 X1.1 30.74,15.79 C3.1
PE10: length 11.1
  Top Layer w0.254: U1.40 37.45,26.65 v1(37.59,26.8) ; v4(41.53,22.73) 41.52,22.72 U3.16
  Inner1 w0.254: v4(41.53,22.73) 42.93,24.13 42.93,25.91 42.04,26.8 v1(37.59,26.8)
PE12: length 14.9
  Top Layer w0.254: U1.43 37.3,28.15 v1(37.72,28.57) ; v4(43.05,21.97) 43.29,21.74 43.31,21.74 43.44,21.61 U3.12
  Inner1 w0.254: v1(37.72,28.57) 42.04,28.57 44.32,26.29 44.32,23.24 v4(43.05,21.97)
POWER_OUT1: length 15
  Top Layer w0.254: 26.54,17.02 26.33,17.23 U1.8
  Inner1 w0.254: v1(26.67,16.89) 36.96,16.89 38.23,15.62 v1(38.61,15.62)
  Bottom Layer w0.254: R50.2 39.83,15.6 38.87,15.6 38.65,15.82
POWER_OUT2: length 15.1
  Top Layer w0.254: U1.7 25.83,17.19 25.4,16.76 13.97,16.76 13.55,16.35 C37.2 13.54,16.14 R55.2
SPI2_CS0(PC00): length 27.9
  Top Layer w0.254: U3.14 42.42,21.17 v4(42.42,22.1) ; U1.15 29.83,20.18 v1(29.84,20.19)
  Inner1 w0.254: v1(29.84,20.19) 29.84,24.13 33.66,27.94 42.04,27.94 43.81,26.16 43.81,23.49 v4(42.42,22.1)
SPI2_CS1(PC03): length 23
  Top Layer w0.254: U1.18 31.33,19.18 32.13,19.99 v1(32.13,20.95) ; U3.5 43.94,26.45 43.72,26.67 39.33,26.67 38.19,25.53 v1(37.72,25.53)
  Inner1 w0.254: v1(37.72,25.53) 37.47,25.53 36.81,26.18 33.68,26.18 32.13,24.64 v1(32.13,20.95)
SPI2_MISO(PC02): length 29.8
  Top Layer w0.254: U1.17 30.83,19.4 v1(30.86,19.43) ; v4(41.91,21.46) 41.94,21.44 U3.15 41.94,20.67 42.16,20.45 44.2,20.45 44.44,20.69 U3.10
  Inner1 w0.254: v4(41.91,21.46) 41.91,22.35 43.43,23.88 43.43,25.91 41.78,27.56 34.29,27.56 30.86,24.13 v1(30.86,19.43)
SPI2_MOSI(PC01): length 29.8
  Top Layer w0.254: U3.9 44.94,21.66 44.99,21.72 v2(45.09,21.72) ; v1(31.5,20.32) 30.86,20.32 30.33,19.79 U1.16
  Inner1 w0.254: v1(31.5,20.32) 31.88,20.32 32.26,19.94 32.26,18.03 32.77,17.53 v1(36.19,17.53)
  Bottom Layer w0.254: v2(45.09,21.72) 44.2,22.61 44.2,24.89 43.56,25.53 39.24,25.53 38.61,24.89 38.61,18.16 37.97,17.53 v1(36.19,17.53)
SPI2_SCK(PB13): length 19.2
  Top Layer w0.254: U1.52 34.33,32.17 v1(34.29,32.13) ; U3.8 45.35,22.47 v2(45.21,22.61)
  Inner1 w0.254: v1(34.29,32.13) 34.29,30.61 35.69,29.21 42.04,29.21 44.7,26.54 44.7,23.11 v2(45.21,22.61)
SPI6_MOSI(PA07): length 9.3
  Top Layer w0.254: U1.31 38.03,22.15 38.48,22.61 38.48,25.02 39.38,25.92 LED1.2
SWCLK: length 17.8
  Top Layer w0.254: v1(20.19,31.62) 21.25,31.62 U1.76
  Bottom Layer w0.254: v1(20.19,31.62) 17.15,31.62 14.73,34.04 14.73,36.96 11.75,39.93 8.65,39.93
SWDIO: length 22.2
  Top Layer w0.254: U1.72 24.33,32.06 v1(24.38,32)
  Bottom Layer w0.254: v1(24.38,32) 23.37,30.99 17.02,30.99 13.97,34.04 13.97,36.83 12.06,38.73 R15.1
TIM1_CH1(PE09): length 15.7
  Top Layer w0.254: v1(45.34,33.58) 43.18,33.58 42.54,32.94 42.54,29.59 41.91,28.96 39.62,28.96 39.12,28.45 39.12,27.43 37.84,26.15 U1.39
  Bottom Layer w0.254: 46.48,33.58 v1(45.34,33.58)
TIM1_CH3(PE13): length 17.7
  Top Layer w0.254: v1(45.72,36.32) 41.78,36.32 41.28,35.81 41.28,29.72 41.02,29.46 39.24,29.46 38.61,28.83 38.61,28.07 38.19,27.65 U1.42
  Bottom Layer w0.254: v1(45.72,36.32) 45.74,36.3 R41.2
TIM2_CH1(PA00): length 23.4
  Top Layer w0.254: v1(33.15,19.43) 33.33,19.25 U1.22
  Bottom Layer w0.254: 46.48,28.5 40.59,28.5 39.88,29.21 36.7,29.21 36.07,28.57 36.07,25.15 35.05,24.13 35.05,20.19 34.54,19.68 33.4,19.68 v1(33.15,19.43)
TIM2_CH3(PA02): length 23.3
  Top Layer w0.254: v1(34.42,20.95) 34.33,20.87 U1.24
  Bottom Layer w0.254: R39.2 46.27,30.86 40.75,30.86 39.86,29.97 36.32,29.97 35.31,28.96 35.31,25.27 34.42,24.38 v1(34.42,20.95)
TIM3_CH4(PB01): length 13.4
  Top Layer w0.254: v1(37.85,24.13) 37.82,24.15 U1.35
  Inner1 w0.254: v1(37.85,24.13) 39.75,26.03 42.16,26.03 42.54,25.65 42.54,24.51 40.89,22.86 40.89,22.35 41.4,21.84 v1(41.4,20.95)
  Bottom Layer w0.254: R33.1 41.75,20.6 v1(41.4,20.95)
TIM12_CH2(PB15): length 9.4
  Top Layer w0.254: v1(33.27,32) 33.33,32.06 U1.54
  Bottom Layer w0.254: R37.1 36.73,33.68 36.45,33.4 36.45,31.88 36.07,31.5 33.66,31.5 33.27,31.88 v1(33.27,32)
UART5_RX(PD02): length 33.1
  Top Layer w0.254: v1(32.38,31.11) 32.38,29.97 31.88,29.46 24,29.46 22.69,28.15 U1.83 ; v1(45.21,34.54) 45.35,34.4 Q5.3 46.5,34.42 47.37,34.42 47.37,34.83 R75.1
  Bottom Layer w0.254: v1(32.38,31.11) 32.38,33.15 32.89,33.65 35.18,33.65 36.07,34.54 37.08,34.54 39.12,36.58 43.54,36.58 45.21,34.9 v1(45.21,34.54)
UART7_RX(PE07): length 19.1
  Top Layer w0.254: U1.37 34.3,25.15 v1(34.04,24.89) ; v1(44.83,16.51) R16.1
  Inner1 w0.254: v1(44.83,16.51) 43.94,17.4 38.61,17.4 36.83,19.18 36.83,21.21 34.04,24 v1(34.04,24.89)
UART7_TX(PE08): length 21.3
  Top Layer w0.254: v1(34.04,25.65) 34.06,25.68 36.36,25.68 U1.38 ; v1(44.83,15.49) R17.1
  Inner1 w0.254: v1(34.04,25.65) 33.4,25.02 33.4,23.88 36.32,20.95 36.32,18.8 38.1,17.02 43.31,17.02 v1(44.83,15.49)
UART10_RX(PE02): length 23.8
  Top Layer w0.254: v1(22.73,19.43) 22.73,19.3 22.86,19.18 22.86,18.13 U1.1 ; v1(9.53,29.46) R18.1
  Bottom Layer w0.254: v1(9.53,29.46) 10.16,29.46 10.41,29.21 10.41,26.16 11.18,25.4 21.21,25.4 22.84,23.77 22.84,19.54 v1(22.73,19.43)
UART10_TX(PE03): length 25.1
  Top Layer w0.254: R19.1 v1(9.53,30.73) ; v1(23.37,19.94) 23.33,19.9 U1.2
  Bottom Layer w0.254: v1(9.53,30.73) 10.03,30.73 10.92,29.84 10.92,26.42 11.56,25.78 21.59,25.78 23.37,24 v1(23.37,19.94)
USART1_RX(PA10): length 25.7
  Top Layer w0.254: U1.69 25.83,34.5 v1(25.78,34.54) ; v1(44.58,39.37) 45.09,39.37 45.47,39.75 R21.1
  Inner1 w0.254: v1(44.58,39.37) 44.18,39.37 43.65,39.9 28.85,39.9 26.67,37.72 26.67,35.69 25.78,34.8 v1(25.78,34.54)
USART1_TX(PA09): length 25.1
  Top Layer w0.254: R20.1 46.05,40.89 44.96,40.89 v1(43.43,39.37) ; v1(26.54,34.67) 26.33,34.46 U1.68
  Inner1 w0.254: v1(26.54,34.67) 27.18,35.31 27.18,37.46 29.08,39.37 v1(43.43,39.37)
USART2_DE(PD04): length 13.9
  Top Layer w0.254: v3(24.97,38.34) 24.77,38.13 U20.3 U20.2 ; U1.85 22.96,27.15 v3(23.24,27.43)
  Inner1 w0.254: v3(23.24,27.43) 23.24,35.69 v3(23.5,35.94)
  Bottom Layer w0.254: v3(24.97,38.34) 24.97,38.6 R72.2
USART2_RX(PD06): length 13.9
  Top Layer w0.254: U1.87 22.74,26.15 v3(22.86,26.03) ; U20.1 22.22,37.84 v3(22.74,38.36)
  Inner1 w0.254: v3(22.86,26.03) 22.48,26.42 22.48,35.69 v3(22.22,35.95)
  Bottom Layer w0.254: v3(22.74,38.36) 22.81,38.42 R69.1
USART2_TX(PD05): length 13.4
  Top Layer w0.254: v3(24,27.94) 24,27.3 23.35,26.65 U1.86
  Inner1 w0.254: v3(24,27.94) 23.75,28.19 23.75,34.8 24.89,35.94 v3(26.03,35.94)
USART3_DE(PB14): length 10.1
  Top Layer w0.254: U1.53 33.83,34.84 34.42,35.43 36.96,35.43 37.47,35.94 U19.3 ; U19.3 36.07,36.92 ; U19.3 v3(37.47,36.96)
  Bottom Layer w0.254: R71.2 37.54,37.03 v3(37.47,36.96)
USART3_RX(PD09): length 11.4
  Top Layer w0.254: v3(32.26,34.92) 32.33,34.85 U1.56 ; v3(34.93,37.85) 34.93,37.05 34.8,36.92
  Inner1 w0.254: v3(34.93,37.85) 36.37,37.85 36.46,37.76 36.46,37.63 34.99,36.16 32.76,36.16 32.44,35.83 32.44,35.53 32.26,35.36 v3(32.26,34.92)
  Bottom Layer w0.254: R70.1 34.93,38.41 v3(34.93,37.85)
USART3_TX(PD08): length 10.4
  Top Layer w0.254: v3(33.02,34.42) 32.83,34.42 32.83,34.42 U1.55 ; 38.61,36.92 38.61,37.64 v3(38.4,37.85)
  Inner1 w0.254: v3(38.4,37.85) 36.96,37.85 36.87,37.76 36.87,37.46 35.16,35.75 32.93,35.75 32.84,35.66 32.84,35.53 33.02,35.36 v3(33.02,34.42)
USB_DM: length 4.3
  Top Layer w0.254: USB1.7 8.6,18.92 9.4,18.92 9.53,19.05 9.53,19.81 9.41,19.93 USB1.5
  Bottom Layer w0.254: D2.3 10.46,19.68 R1.2
  vias: v1(9.65,19.56)
USB_DP: length 6.1
  Top Layer w0.254: USB1.6 7.87,19.43 7.62,19.18 7.62,18.67 7.86,18.43 USB1.8 9.64,18.43 v1(9.65,18.41)
  Bottom Layer w0.254: v1(9.65,18.41) 9.29,18.05 R2.2 10.71,17.65 D2.2
USB_VBUS: length 14.6
  Top Layer w0.254: v1(12.7,19.43) 12.7,21.08 12.21,21.58 v1(8.6,21.58)
  Bottom Layer w0.254: v1(8.51,16.76) 8.51,18.29 8.13,18.67 7.24,18.67 6.28,19.63 D3.2 8,20.95 8.51,21.46 ; D2.4 12.66,19.47 v1(12.7,19.43)
USER_KEY(PA15): length 39.4
  Top Layer w0.254: v1(41.78,38.73) 43.43,40.39 R76.1 43.67,48.68 SW1.2 ; v1(26.54,31.5) 25.4,30.35 24.26,30.35 23.46,31.15 U1.77
  Inner1 w0.254: v1(41.78,38.73) 28.95,38.73 27.69,37.47 27.69,32.64 v1(26.54,31.5)
$1N788: length 29.3
  Top Layer w0.254: v1(25.91,31.88) 25.78,31.88 25.33,32.33 U1.70
  Inner1 w0.254: v1(25.91,31.88) 25.91,26.92 19.18,20.19 7.49,20.19 v1(6.99,19.68)
  Bottom Layer w0.254: v1(6.99,19.68) R1.1
$1N1228: length 1.2
  Top Layer w0.254: USB1.10 9.72,17.43 R12.2
$1N1231: length 1.2
  Top Layer w0.254: 9.73,20.37 9.68,20.43 USB1.4
$1N1932: length 1.8
  Top Layer w0.254: C1.2 37.51,30.65 U1.48
$1N2002: length 2.6
  Top Layer w0.254: v3(24.64,30.99) 23.83,31.8 U1.73
$1N2431: length 3.3
  Top Layer w0.254: R8.1 51.18,26.67 51.18,27.3 51.44,27.56 52.35,27.56 H1.1
$1N3470: length 31.9
  Top Layer w0.254: v1(25.27,31.62) 25.27,31.88 24.83,32.32 U1.71
  Inner1 w0.254: v1(25.27,31.62) 25.27,27.18 18.67,20.57 6.86,20.57 5.97,19.68 5.97,18.54 v1(6.86,17.65)
  Bottom Layer w0.254: R2.1 7.78,17.65 v1(6.86,17.65)
$1N5240: length 2.7
  Top Layer w0.254: CN1.3 7.16,38.87 v1(7.27,38.76)
  Bottom Layer w0.254: 7.97,37.62 7.97,38.59 R15.2 7.8,38.76 v1(7.27,38.76)
$1N5247: length 2.6
  Top Layer w0.254: CN1.2 7.09,40.12 v1(7.27,39.93)
  Bottom Layer w0.254: v1(7.27,39.93) R14.2 7.78,40.98 D5.2
$1N6177: length 3.9
  Top Layer w0.254: CN2.3 48.4,18.17 46.78,16.56 46.45,16.56 ; 46.45,16.56 46.41,16.51 ; 46.45,16.56 D6.2
$1N6216: length 3.9
  Top Layer w0.254: CN2.4 47.91,16.92 46.48,15.49 46.41,15.49 46.41,14.72 D7.2
$1N6255: length 3.2
  Top Layer w0.254: CN3.3 7.45,30.09 R18.2 8.08,28.33 D8.2
$1N6294: length 3.2
  Top Layer w0.254: CN3.4 7.47,31.34 8.04,30.76 ; 8.04,30.76 R19.2 ; 8.04,30.76 D9.2
$1N6370: length 2.9
  Top Layer w0.254: CN4.4 48.65,39.75 R21.2 47.04,38.63 D11.2
$1N6409: length 2.9
  Top Layer w0.254: CN4.3 48.63,41.02 R20.2 47.04,42.17 D10.2
$1N8894: length 2.7
  Bottom Layer w0.254: R33.2 R32.2 43.92,19.18 Q1.1
$1N8904: length 16
  Top Layer w0.127: 40.39,23.93 40.89,23.42 40.89,22.4 R28.1 39.88,21.39 39.88,20.37 R26.1 ; v1(46.48,19.86) 46.48,20.07 45.97,20.57 45.97,21.59 46.28,21.9 R29.1 46.99,22.4 46.99,23.42 46.48,23.93
  Top Layer w0.254: R26.1 R24.1 R25.1 R23.1 R22.1 v1(46.48,19.86)
$1N9624: length 2.8
  Bottom Layer w0.254: D12.2 43.81,31.92 Q2.3
  vias: v1(44.08,31.6)
$1N9801: length 3
  Bottom Layer w0.254: R36.2 40.31,33.72 ; 40.31,33.72 40.33,33.74 Q2.1 ; 40.31,33.72 R37.2
$1N12163: length 3.3
  Bottom Layer w0.254: R38.1 47.56,27.63 D16.2 49.34,27.58 H2.4
$1N12202: length 3.3
  Bottom Layer w0.254: R39.1 47.51,30.21 D15.2 49.36,30.14 H2.3
$1N12241: length 3.3
  Bottom Layer w0.254: R40.1 47.52,32.71 D14.2 49.31,32.63 H2.2
$1N12280: length 3.3
  Bottom Layer w0.254: R41.1 47.5,35.43 D13.2 47.76,35.5 H2.1
$2N672: length 2.7
  Bottom Layer w0.254: U4.6 18.49,7.37 18.17,7.05 C19.1
$2N676: length 8.7
  Bottom Layer w0.254: 17.59,5.65 18.81,6.87 U4.5 ; 17.59,5.65 21.32,5.65 L1.1 ; 17.59,5.65 16.51,5.65
$2N851: length 3.4
  Bottom Layer w0.254: 16.51,9.84 18.48,7.87 U4.7
$2N1199: length 1.4
  Top Layer w0.254: U5.4 35.94,8.5 R44.2
$2N1321: length 3.1
  Top Layer w0.254: U5.1 33.94,4.73 32.89,3.68 v1(32.64,3.68)
$2N1394: length 2.1
  Bottom Layer w0.254: C25.1 31.62,3.73 R45.2
$2N1506: length 9.9
  Top Layer w0.254: R46.2 v1(30.11,8.56) 30.38,8.56 L2.1 30.92,8.39 U5.6
  Bottom Layer w0.254: D17.1 29.42,8.25 30.99,8.25 31.62,7.62 C25.2
  vias: v1(29.21,8.5) v1(29.21,7.45) v1(30.1,7.49)
$2N1628: length 1.4
  Top Layer w0.254: R46.1 C26.2
$2N2825:
  vias: v1(41.99,12.44)
$2N2906: length 2.7
  Bottom Layer w0.254: R50.1 39.91,14.72 Q3.1 41.6,15.23 R51.2
$2N3293: length 9.8
  Top Layer w0.254: v1(39.93,12.45) 41.13,12.45
  Bottom Layer w0.254: v1(39.38,6.1) 39.38,9.03 39.96,9.61 v1(41.51,9.61) 41.51,10.55 C34.1 41,11.74 40.3,12.45
$2N3476: length 1.9
  Top Layer w0.254: LED2.2 39.37,5.02 R52.1
$2N4049: length 0.6
  Top Layer w0.254: 11.68,12.83 11.81,12.7 R54.1
  vias: v1(11.68,12.97)
$2N4051: length 1.8
  Top Layer w0.254: v1(10.73,14.97) 11.24,14.97 R56.2 11.33,15.16 R55.1
$2N4063: length 10
  Top Layer w0.254: v1(11.82,6.84) 12.7,5.95 R57.2 ; 12.45,10.92 12.68,11.15 R54.2 v1(13.88,12.28) R53.1
  Bottom Layer w0.254: v1(12.43,10.91) 12.43,7.35 11.94,6.86 ; D19.1 13.85,12.32 v1(13.88,12.28)
$2N4088: length 1.2
  Top Layer w0.254: LED3.2 12.7,2.71 R57.1
$3N2644: length 19.7
  Top Layer w0.254: R58.2 11.61,44.39 11.81,44.18 L7.3 12.43,42.27 11.43,41.27 11.43,37.46 12.19,36.7 R61.1 12.2,36.06 v3(12.32,35.94)
  Inner1 w0.254: v3(12.32,35.94) 13.84,34.42 13.84,28.83 13.46,28.45 v3(13.08,28.45)
$3N2661: length 4.1
  Top Layer w0.254: R61.2 13.72,36.71 F1.1 13.59,39.63 L7.2
$3N2670: length 18.7
  Top Layer w0.254: R58.1 10.74,44.4 10.54,44.2 9.94,44.2 L7.4 9.93,42.27 10.92,41.27 10.92,37.47 R62.1 10.15,35.94 10.28,35.81 v3(10.41,35.81)
  Inner1 w0.254: v3(13.08,29.72) 13.34,29.97 13.34,32.89 v3(10.41,35.81)
$3N2687: length 4.3
  Top Layer w0.254: R62.2 8.64,39.37 8.51,39.51 9.8,39.51 L7.1
$3N2696: length 10
  Top Layer w0.254: R63.1 18.18,37.58 18.18,42.69 v3(18.29,42.8) 18.29,43.81 18.66,44.18 ; L8.3 18.66,44.18 ; 18.66,44.18 18.55,44.18 18.21,44.52 18.21,45.47
$3N2713: length 4.3
  Top Layer w0.254: L8.2 20.32,39.63 20.57,39.38 R63.2
$3N2722: length 9.8
  Top Layer w0.254: R64.1 17.4,37.22 v3(17.4,42.8) 17.4,43.81 17.03,44.18 16.88,44.18 ; 16.88,44.18 17.35,44.65 17.35,45.47 ; 16.88,44.18 L8.4
$3N2737: length 4.2
  Top Layer w0.254: L8.1 16.4,39.51 F4.1 15.24,36.84 R64.2
$3N5638: length 10.3
  Top Layer w0.254: R60.1 30.05,44.27 29.84,44.07 29.24,44.07 29.23,44.06 29.23,43.79 v3(29.84,43.18) ; R66.1 30.1,37.73 v3(30.1,38.1)
  Bottom Layer w0.254: v3(30.1,38.1) 29.84,38.35 U15.6 v3(29.84,43.18)
$3N5658: length 4.6
  Top Layer w0.254: R66.2 27.56,36.69 F6.1 29.1,39.38 29.23,39.51
$3N5675: length 4.4
  Top Layer w0.254: R65.2 33.39,39.13 F5.1 33.02,39.51 31.73,39.51
$3N5682: length 10.6
  Top Layer w0.254: R60.2 30.91,44.27 31.12,44.07 31.72,44.07 31.73,44.06 31.73,43.79 v3(31.12,43.18) ; R65.1 30.86,37.6 v3(30.86,38.1)
  Bottom Layer w0.254: v3(30.86,38.1) 31.12,38.35 v3(31.12,43.18) 31.37,43.43
$4N1182: length 3
  Top Layer w0.254: U20.7 23.5,43.44 F9.1 23.1,44.08 v3(23.11,44.07)
  Bottom Layer w0.254: v3(23.11,44.07) 23.32,44.07 R73.2
$4N1191: length 3.2
  Top Layer w0.254: U20.6 24.77,43.39 F10.1 25.38,44.07 v3(24.77,44.07)
  Bottom Layer w0.254: R73.1 24.51,43.81 v3(24.77,44.07)
$4N1200: length 2.5
  Top Layer w0.254: 36.07,42.33 36.2,42.46 v3(36.2,44.06) 36.06,44.2 F7.1
$4N1209: length 2.3
  Top Layer w0.254: 37.91,44.14 37.84,44.07 v3(37.47,44.07) 37.47,42.2
$4N1963: length 6
  Top Layer w0.254: H3.1 51.18,29.21 48.26,29.21 47.5,29.97 R74.1
$4N2044: length 3
  Top Layer w0.254: Q5.1 46.09,32.4 46.48,32 46.48,31.24 46.74,30.99 47.46,30.99 R74.2
$5N5796: length 1.8
  Top Layer w0.635: LED4.2 44.42,5.84 R99.2
$5N5839: length 1.9
  Top Layer w0.635: R98.2 44.28,1.52 LED5.2
$5N5882: length 1.8
  Top Layer w0.635: R97.2 44.54,3.05 LED6.2
$5N5925: length 1.7
  Top Layer w0.635: R96.2 44.67,4.44 LED7.2

## Copper pours and planes (outline as drawn; the poured copper is in the pictures)
+5V on Bottom Layer: 23.9,10.62 26.86,10.62 26.93,10.55 26.93,5.09 26.67,4.83 23.9,4.83 23.9,10.61
+5V on Inner2: 23.88,10.41 26.8,10.41 26.8,4.83 23.88,4.83
+5VS on Top Layer: 28.51,5.84 32.77,5.84 33.11,5.5 33.11,3.9 33.47,3.54 35.82,3.54 36.44,2.92 37.84,2.92 37.84,1.9 35.46,1.9 35.08,2.29 28.76,2.29 28.5,2.54 28.5,5.84
+5VS on Inner2: 29.96,3.43 35.69,3.43 35.69,1.9 29.96,1.9
GND on Top Layer: 15.49,15.63 21,15.63 21.11,15.51 21.11,11.08 21.96,10.23 22.78,10.23 22.99,10.03 22.99,3.1 15.49,3.1
GND on Top Layer: -5.59,55.75 61.34,55.75 61.34,-4.83 -5.59,-4.83
GND on Top Layer: 25.16,13.51 32.08,13.51 33.14,12.45 34.82,12.45 35.22,12.06 35.22,11.4 34.87,11.05 25.27,11.05 25.15,10.92 25.15,13.49
GND on Bottom Layer: -2.79,56.51 59.43,56.51 59.43,-4.7 -2.79,-4.7
VCC on Bottom Layer: 36.45,9.9 37.62,9.9 37.78,9.74 37.78,4.57 36.57,4.57 36.45,4.7
VCC on Inner2: 36.45,9.93 37.86,9.93 37.86,4.56 36.45,4.56
VCC_IN on Top Layer: 13.04,6.1 13.05,6.1 15.24,6.1 15.24,11.56 15.11,11.68 13.47,11.68 13.47,9.95 13.3,9.95 13.04,9.69
VCC_IN on Top Layer: 36.2,11.1 39.62,11.1 40.56,10.16 40.56,6.9 38.44,6.9 38.23,7.11 38.23,10.03 35.81,10.03 35.69,10.16 36.2,10.68
VCC_IN on Top Layer: 21.59,15.24 24.38,15.24 24.89,14.73 24.89,11.55 25.13,11.3 31.5,11.3 32.03,10.77 35.13,10.77 35.46,11.1 36.44,11.1 36.44,10.04 36.45,10.03 35.28,10.03 35.09,9.84 34.93,9.84 34.74,9.65 21.58,9.65 21.59,9.66
VCC_IN on Bottom Layer: 13.47,11.64 15.24,11.64 15.24,6.35 15.11,6.22 13.04,6.22 13.04,9.74 13.47,10.17
VCC_IN on Bottom Layer: 21.59,15.24 24.38,15.24 24.89,14.73 24.89,10.78 14.1,10.78 13.78,10.46 13.78,12.17 14.38,12.76 16.77,12.76 17.53,12 20.76,12 21.59,12.83
VCC_OUTPUT1 on Top Layer: 40.74,9.18 44.15,9.18 44.43,9.46 44.43,11.74 45.77,13.08 49.66,13.08 50.04,12.7 50.04,8.13 49.02,7.11 40.76,7.11 40.74,7.13
VCC_OUTPUT2 on Top Layer: 5.46,12.57 9.46,12.57 9.82,12.21 9.82,9.57 10.22,9.17 12.31,9.17 12.43,9.05 12.43,7.35 12.22,7.14 5.46,7.14
$2N676 on Bottom Layer: 15.86,6.36 17.87,6.36 18.38,6.87 19.39,6.87 19.81,6.45 19.81,6.35 21.21,6.35 21.84,6.98 21.84,8.76 21.97,8.64 23.5,8.64 23.5,4.89 15.81,4.89 15.75,4.95 15.86,5.07
$2N1506 on Top Layer: 27.31,9.07 34.11,9.07 34.42,8.76 34.42,7.24 34.29,7.11 28.64,7.11 28.64,8.03 27.31,8.03 27.31,8.04
